# Altium schematic sheet Ethernet.SchDoc
size A4; SheetNumber: 4; SheetTotal: 12
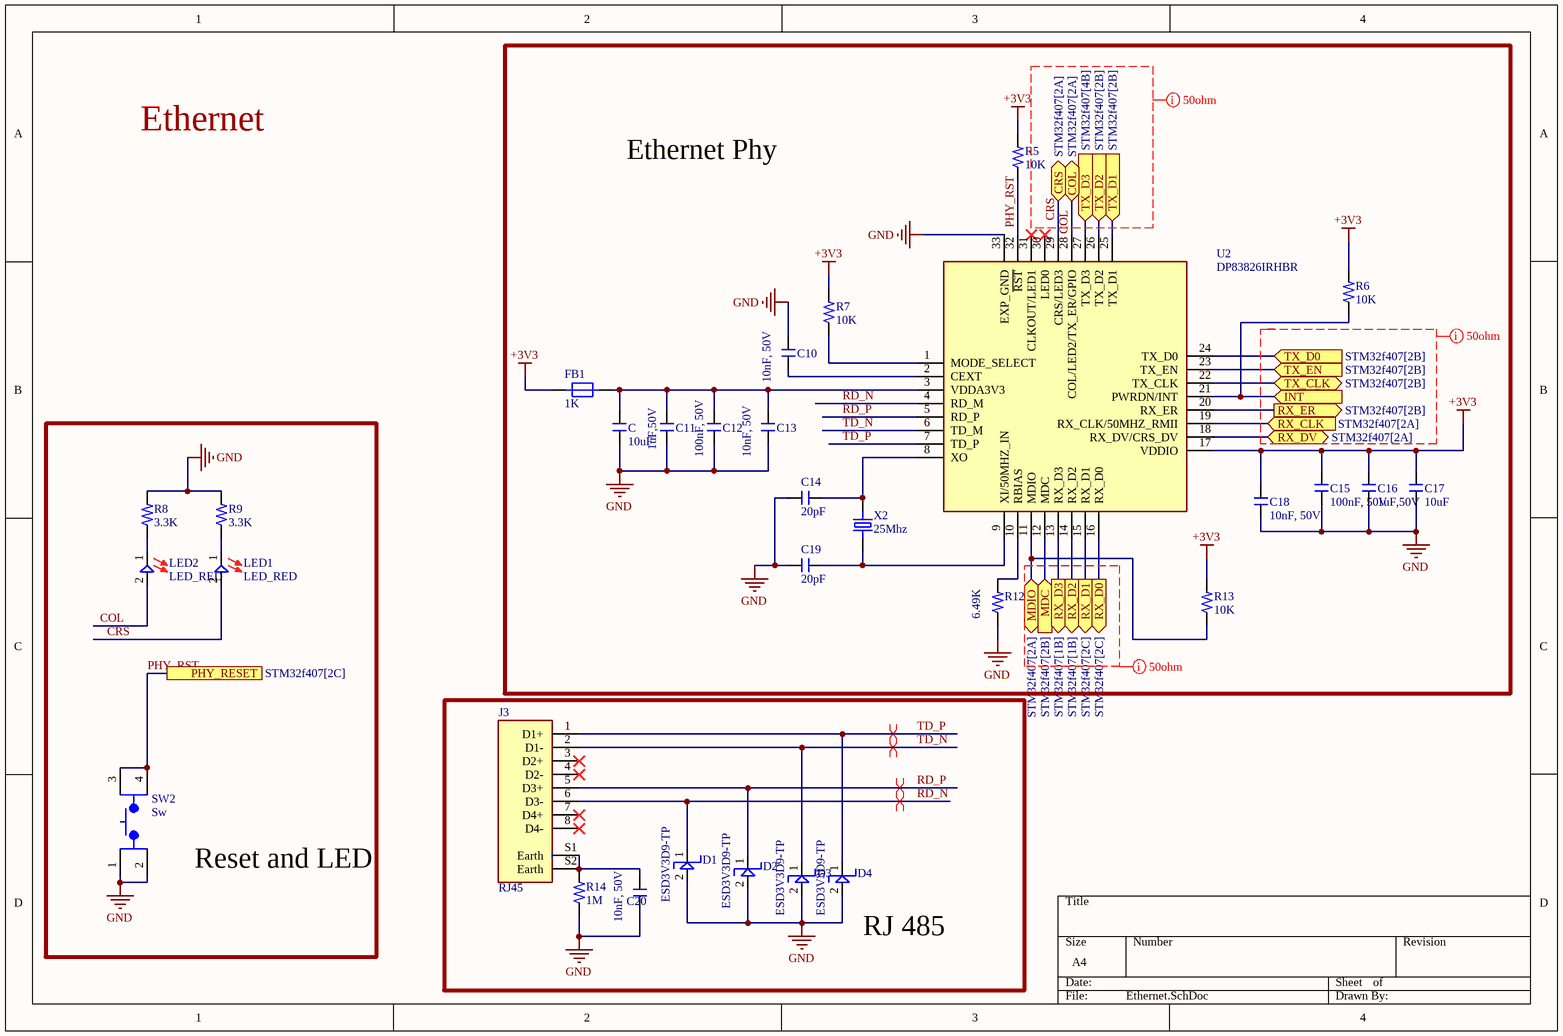
[diagram p0: Ethernet.SchDoc]

## Parts
C  10uF  [Capacitor_1206_SMD]
C10  10nF, 50V  [Capacitor_0805]
C11  1uF,50V  [Capacitor_0805]
C12  100nF, 50V  [Capacitor_0805]
C13  10nF, 50V  [Capacitor_0805]
C14  20pF  [Capacitor_0805]
C15  100nF, 50V  [Capacitor_0805]
C16  1uF,50V  [Capacitor_0805]
C17  10uF  [Capacitor_1206_SMD]
C18  10nF, 50V  [Capacitor_0805]
C19  20pF  [Capacitor_0805]
C20  10nF, 50V  [Capacitor_0805]
D1  ESD3V3D9-TP  [SOD_923]
D2  ESD3V3D9-TP  [SOD_923]
D3  ESD3V3D9-TP  [SOD_923]
D4  ESD3V3D9-TP  [SOD_923]
FB1  1K  [FB_0805]
J3  RJ45  [RJ45_Right_Angle_90_degree]
LED1  LED_RED  [LTST-C171KRKT]
LED2  LED_RED  [LTST-C171KRKT]
R5  10K  [Resistor_0603]
R6  10K  [Resistor_0603]
R7  10K  [Resistor_0603]
R8  3.3K  [Resistor_0603]
R9  3.3K  [Resistor_0603]
R12  6.49K  [Resistor_0805]
R13  10K  [Resistor_0603]
R14  1M  [Resistor_1206_SMD]
SW2  Sw  [SW_Tactile_SMD]
U2  DP83826IRHBR  [32-VQFN (5x5)]
X2  25Mhz  [Xtal_314_240X47_SMD]

## Blocks framed on the sheet
Ethernet Phy: C C10-C19 FB1 R5-R7 R12 R13 U2 X2
Reset and LED: LED1 LED2 R8 R9 SW2
RJ 485: C20 D1-D4 J3 R14

## Ports
COL (bidir, see STM32f407[2A]), CRS (bidir, see STM32f407[2A]), INT (in), MDC (in, see STM32f407[2B]), MDIO (bidir, see STM32f407[2A]), PHY_RESET (see STM32f407[2C]), RX_CLK (in, see STM32f407[2A]), RX_D0 (out, see STM32f407[2C]), RX_D1 (out, see STM32f407[2C]), RX_D2 (out, see STM32f407[1B]), RX_D3 (out, see STM32f407[1B]), RX_DV (bidir, see STM32f407[2A]), RX_ER (out, see STM32f407[2B]), TX_CLK (bidir, see STM32f407[2B]), TX_D0 (in, see STM32f407[2B]), TX_D1 (in, see STM32f407[2B]), TX_D2 (in, see STM32f407[2B]), TX_D3 (in, see STM32f407[4B]), TX_EN (in, see STM32f407[2B])

## Nets
+3V3: C15.2 C16.2 C17.2 C18.2 FB1.1 R5.2 R6.2 R7.2 R13.2 U2.17(VDDIO)
GND: C.1 C10.2 C11.1 C12.1 C13.1 C14.1 C15.1 C16.1 C17.1 C18.1 C19.1 C20.1 D1.2 D2.2 D3.2 D4.2 R8.2 R9.2 R12.1 R14.1 SW2.1 SW2.2 U2.33(EXP_GND)
COL: LED2.2 U2.28(COL/LED2/TX_ER/GPIO) ; port COL
CRS: LED1.2 U2.29(CRS/LED3) ; port CRS
INT: R6.1 U2.21(PWRDN/INT) ; port INT
MDC: U2.12(MDC) ; port MDC
MDIO: R13.1 U2.11(MDIO) ; port MDIO
PHY_RST: R5.1 SW2.3 SW2.4 U2.32(~{RST}) ; port PHY_RESET
RD_N: D1.1 J3.6(D3-) U2.4(RD_M)
RD_P: D2.1 J3.5(D3+) U2.5(RD_P)
RX_CLK: U2.19(RX_CLK/50MHZ_RMII) ; port RX_CLK
RX_D0: U2.16(RX_D0) ; port RX_D0
RX_D1: U2.15(RX_D1) ; port RX_D1
RX_D2: U2.14(RX_D2) ; port RX_D2
RX_D3: U2.13(RX_D3) ; port RX_D3
RX_DV: U2.18(RX_DV/CRS_DV) ; port RX_DV
RX_ER: U2.20(RX_ER) ; port RX_ER
TD_N: D3.1 J3.2(D1-) U2.6(TD_M)
TD_P: D4.1 J3.1(D1+) U2.7(TD_P)
TX_CLK: U2.22(TX_CLK) ; port TX_CLK
TX_D0: U2.24(TX_D0) ; port TX_D0
TX_D1: U2.25(TX_D1) ; port TX_D1
TX_D2: U2.26(TX_D2) ; port TX_D2
TX_D3: U2.27(TX_D3) ; port TX_D3
TX_EN: U2.23(TX_EN) ; port TX_EN
NetC10_1: C10.1 U2.2(CEXT)
NetC14_2: C14.2 U2.8(XO) X2.2
NetC19_2: C19.2 U2.9(XI/50MHZ_IN) X2.1
NetC20_2: C20.2 J3.S1(Earth) J3.S2(Earth) R14.2
NetC_2: C.2 C11.2 C12.2 C13.2 FB1.2 U2.3(VDDA3V3)
NetLED1_1: LED1.1 R9.1
NetLED2_1: LED2.1 R8.1
NetR7_1: R7.1 U2.1(MODE_SELECT)
NetR12_2: R12.2 U2.10(RBIAS)

Not connected (* = marked no-connect by the designer): J3 3(D2+)* 4(D2-)* 7(D4+)* 8(D4-)*; U2 30(LED0)* 31(CLKOUT/LED1)*

## Layout directives
differential pair; net class Diff_Pair_100: RD_N, RD_P, TD_N, TD_P
mark named 50ohm: (no net found under the mark), CRS

## Notes on the sheet
- Ethernet

## Library data of the parts
C C17 = Cap_10uF_1206: Multilayer Ceramic Capacitor, 10 uF, 50 V, ï¿½ 10%, X7R, 1206 [3216 Metric]; Manufacturer: Samsung; Manufacturer Part Number: CL31B106KBHNNNE; Voltage Rating (DC): 50V; Supplier: Digikey; Supplier Part Number: 1276-6767-1-ND; RoHS: Yes; Category: Ceramic Capacitors; Stock: 207136; Pricing: 1=0,25, 10=0,15, 100=0,1008, 1000=0,0728 (USD); Mounting Technology: Surface Mount; Case/Package: 1206; Case Code (Metric): 3216; Case Code (Imperial): 1206; Material: Ceramic; Min Operating Temperature: -55°C; Max Operating Temperature: 125°C; Value: 10uF; Tolerance: 10%; Dielectric: X7R; Packaging: Cut Tape; Voltage Rating: 50V; Series: CL; Height: 1.8mm; Lead Free: Lead Free; RoHS Compliant: Yes; ComponentLink1URL: https://datasheet.octopart.com/CL31B106KBHNNNE-Samsung-Electro-Mechanics-datasheet-149066874.pdf?src-supplier=Future+Electronics; ComponentLink1Description: https://datasheet.octopart.com/CL31B106KBHNNNE-Samsung-Electro-Mechanics-datasheet-149066874.pdf?src-supplier=Future+Electronics; ComponentLink2URL: http://www.samsungsem.com/kr/support/product-search/mlcc/CL31B106KBHNNNE.jsp?src-supplier=Digikey; ComponentLink2Description: http://www.samsungsem.com/kr/support/product-search/mlcc/CL31B106KBHNNNE.jsp?src-supplier=Digikey; ComponentLink3URL: https://datasheet.octopart.com/CL31B106KBHNNNE-Samsung-Electro-Mechanics-datasheet-137256395.pdf?src-supplier=Farnell; ComponentLink3Description: https://datasheet.octopart.com/CL31B106KBHNNNE-Samsung-Electro-Mechanics-datasheet-137256395.pdf?src-supplier=Farnell; ComponentLink4URL: https://datasheet.octopart.com/CL31B106KBHNNNE-Samsung-Electro-Mechanics-datasheet-110617700.pdf?src-supplier=LCSC; ComponentLink4Description: https://datasheet.octopart.com/CL31B106KBHNNNE-Samsung-Electro-Mechanics-datasheet-110617700.pdf?src-supplier=LCSC
C10 C13 C18 C20 = Cap_10nF_0805: Multilayer Ceramic Capacitors MLCC - SMD/SMT 50V 0.01uF X7R 0805 10% AEC-Q200; Manufacturer: KEMET; Manufacturer Part Number: C0805C103K5RECAUTO; Dielectric: 1511DielectricType; Supplier: Arrow Electronics; Supplier Part Number: C0805C103K5RECAUTO; RoHS: Yes; Category: Ceramic Capacitors; Stock: 16; Pricing: 1=0,22, 10=0,0376 (USD); Voltage Rating (DC): 50V; ComponentLink1URL: http://www.farnell.com/datasheets/2723804.pdf?src-supplier=Farnell; ComponentLink1Description: http://www.farnell.com/datasheets/2723804.pdf?src-supplier=Farnell; ComponentLink2URL: https://api.kemet.com/component-edge/download/datasheet/C0805C103K5RECAUTO.pdf?src-supplier=Digikey; ComponentLink2Description: https://api.kemet.com/component-edge/download/datasheet/C0805C103K5RECAUTO.pdf?src-supplier=Digikey; ComponentLink3URL: http://www.farnell.com/datasheets/2723804.pdf?src-supplier=Newark; ComponentLink3Description: http://www.farnell.com/datasheets/2723804.pdf?src-supplier=Newark
C11 C16 = Cap_1uF_0805: 0805 1 uF 50 V ±5 % Tolerance X7R Surface Mount Multilayer Ceramic Capacitor; Manufacturer: Yageo; Manufacturer Part Number: CC0805JKX7R9BB105; Material: 4241ConductorMaterial; Dielectric: 1511DielectricType; Supplier: Digikey; Supplier Part Number: 311-3498-1-ND; RoHS: Yes; Category: Ceramic Capacitors; Stock: 30160; Pricing: 1=0,29, 10=0,168, 100=0,1077, 1000=0,07673 (USD); Voltage Rating (DC): 50V; Height: 1.45mm; Lead Free: 5697LeadFree; Halogen Free: 5694HalogenFree; ComponentLink1URL: https://datasheet.octopart.com/CC0805JKX7R9BB105-Yageo-datasheet-137700082.pdf?src-supplier=Future+Electronics; ComponentLink1Description: https://datasheet.octopart.com/CC0805JKX7R9BB105-Yageo-datasheet-137700082.pdf?src-supplier=Future+Electronics; ComponentLink2URL: http://www.yageo.com/documents/recent/UPY-GPHC_X7R_6.3V-to-50V_18.pdf?src-supplier=Digikey; ComponentLink2Description: http://www.yageo.com/documents/recent/UPY-GPHC_X7R_6.3V-to-50V_18.pdf?src-supplier=Digikey; ComponentLink3URL: https://datasheet.octopart.com/CC0805JKX7R9BB105-Yageo-datasheet-151948686.pdf?src-supplier=Farnell; ComponentLink3Description: https://datasheet.octopart.com/CC0805JKX7R9BB105-Yageo-datasheet-151948686.pdf?src-supplier=Farnell
C12 C15 = Cap_100nF_0805: Multilayer Ceramic Capacitor, 0.1 uF, 50 V, ï¿½ 10%, X7R, 0805 [2012 Metric]; Manufacturer: Samsung; Manufacturer Part Number: CL21B104KBCNNNC; Supplier: Digikey; Supplier Part Number: 1276-1003-1-ND; RoHS: Yes; Category: Ceramic Capacitors; Stock: 674609; Pricing: 1=0,08, 10=0,012, 100=0,0104, 1000=0,008 (USD); Mounting Technology: Surface Mount; Case/Package: 0805; Case Code (Metric): 2012; Case Code (Imperial): 0805; Material: Ceramic; Min Operating Temperature: -55°C; Max Operating Temperature: 125°C; Tolerance: 10%; Value: 100nF; Dielectric: X7R; Packaging: Tape and Reel; Voltage Rating: 50V; Voltage: 50V; Series: CL; Construction: Flat; Voltage Rating (DC): 50V; Length: 2mm; Width: 0.049inch; Height: 0.85mm; Depth: 1.25mm; Thickness: 0.037inch; Radiation Hardening: No; RoHS Compliant: Yes; Lead Free: 5697LeadFree; ComponentLink1URL: https://datasheet.ciiva.com/25710/cl21b104kbcnnnc-25710182.pdf?src-supplier=Digikey; ComponentLink1Description: https://datasheet.ciiva.com/25710/cl21b104kbcnnnc-25710182.pdf?src-supplier=Digikey; ComponentLink2URL: https://datasheet.ciiva.com/29199/454152-da-01-en-vs-kondensator-0805-29199814.pdf?src-supplier=Conrad; ComponentLink2Description: https://datasheet.ciiva.com/29199/454152-da-01-en-vs-kondensator-0805-29199814.pdf?src-supplier=Conrad
C14 C19 = Cap_20pF_0805: Cap Ceramic 20pF 50V C0G 10% SMD 0805 125°C T/R; Manufacturer: Kyocera AVX; Manufacturer Part Number: 08055A200KAT2A; Supplier: Digikey; Supplier Part Number: 478-11887-1-ND; RoHS: Yes; Category: Ceramic Capacitors; Stock: 12473; Pricing: 1=0,19, 10=0,108, 100=0,0669, 1000=0,04597 (USD); ComponentLink1URL: https://datasheet.ciiva.com/204/ccog-204009.pdf?src-supplier=Digikey; ComponentLink1Description: https://datasheet.ciiva.com/204/ccog-204009.pdf?src-supplier=Digikey; ComponentLink2URL: https://datasheet.ciiva.com/11546/ccog-11546664.pdf?src-supplier=Avnet; ComponentLink2Description: https://datasheet.ciiva.com/11546/ccog-11546664.pdf?src-supplier=Avnet
D1-D4 = TVS DIODE 3.3V: Trans Voltage Suppressor Diode, 100W, 3.3V V(RWM), Unidirectional, 1 Element, Silicon; Manufacturer: MCC; Supplier: Digikey; Supplier Part Number: ESD3V3D9-TPMSCT-ND; Manufacturer Part Number: ESD3V3D9-TP; RoHS: Yes; Category: TVS Diodes; Stock: 58922; Pricing: 1=0,21, 10=0,143, 100=0,067, 500=0,063, 1000=0,059, 2000=0,058 (USD); ComponentLink1URL: https://datasheet.ciiva.com/4479/esd3v3d9sod-923-36448-4479598.pdf?src-supplier=Mouser; ComponentLink1Description: https://datasheet.ciiva.com/4479/esd3v3d9sod-923-36448-4479598.pdf?src-supplier=Mouser; ComponentLink2URL: https://datasheet.ciiva.com/333/esd3v3d9sod-923-333173.pdf?src-supplier=Digikey; ComponentLink2Description: https://datasheet.ciiva.com/333/esd3v3d9sod-923-333173.pdf?src-supplier=Digikey; ComponentLink3URL: https://datasheet.ciiva.com/333/esd3v3d9sod-923-333174.pdf?src-supplier=Digikey; ComponentLink3Description: https://datasheet.ciiva.com/333/esd3v3d9sod-923-333174.pdf?src-supplier=Digikey; ComponentLink4URL: https://datasheet.ciiva.com/333/esd3v3d9sod-923-333175.pdf?src-supplier=Digikey; ComponentLink4Description: https://datasheet.ciiva.com/333/esd3v3d9sod-923-333175.pdf?src-supplier=Digikey
FB1 = FB_BLM21SP102SH1D: Ferrite Beads Multi-Layer High Current 1KOhm 25% 100MHz 1.6A 0.12Ohm DCR 0805 Automotive T/R; Manufacturer: Murata; Core Material: 228ConductorMaterial; Value: 120mR; Supplier: Mouser; Supplier Part Number: 81-BLM21SP102SH1D; Manufacturer Part Number: BLM21SP102SH1D; RoHS: Yes; Category: Ferrite Beads and Chips; Stock: 4751; Pricing: 1=0,33, 10=0,179, 50=0,179, 100=0,159, 1000=0,105, 10000=0,083 (USD); RMS Current (Irms): 1.6A; ESR: 120mR; Test Frequency: 100MHz; Tolerance: 25%; Height: 1.05mm; ComponentLink1URL: https://datasheet.octopart.com/BLM21SP102SH1D-Murata-datasheet-138707452.pdf?src-supplier=Future+Electronics; ComponentLink1Description: https://datasheet.octopart.com/BLM21SP102SH1D-Murata-datasheet-138707452.pdf?src-supplier=Future+Electronics; ComponentLink2URL: https://www.murata.com/en-us/api/pdfdownloadapi?cate=luNoiseSupprFilteChipFerriBead&amp;partno=BLM21SP102SH1%23&src-supplier=Digikey; ComponentLink2Description: https://www.murata.com/en-us/api/pdfdownloadapi?cate=luNoiseSupprFilteChipFerriBead&amp;partno=BLM21SP102SH1%23&src-supplier=Digikey; ComponentLink3URL: https://datasheet.octopart.com/BLM21SP102SH1D-Murata-datasheet-166171483.pdf?src-supplier=TME; ComponentLink3Description: https://datasheet.octopart.com/BLM21SP102SH1D-Murata-datasheet-166171483.pdf?src-supplier=TME
J3 = CON_LAN_RJ45: Conn RJ-45 F 8 POS 2.54mm Solder RA Thru-Hole 8 Terminal 1 Port; Manufacturer: Assmann; Manufacturer Part Number: A-2004-2-4-LPS-N-R; Supplier: Digikey; Supplier Part Number: AE10387-ND; RoHS: Yes; Category: Modular / Ethernet Connectors; Stock: 16450; Pricing: 1=1,39, 10=1,178, 25=1,1036, 50=1,0508, 100=1,0006, 300=0,92593, 500=0,89314, 1000=0,85049, 2500=0,79726 (USD); ComponentLink1URL: https://datasheet.ciiva.com/30247/a-2004-2-4-lps-n-r-30247832.pdf?src-supplier=Onlinecomponents.com; ComponentLink1Description: https://datasheet.ciiva.com/30247/a-2004-2-4-lps-n-r-30247832.pdf?src-supplier=Onlinecomponents.com; ComponentLink2URL: https://datasheet.ciiva.com/685/a-2004-2-4-lps-n-r-685830.pdf?src-supplier=Digikey; ComponentLink2Description: https://datasheet.ciiva.com/685/a-2004-2-4-lps-n-r-685830.pdf?src-supplier=Digikey
LED1 LED2 = LED_RED_SMD: OPTOELECTRONICS - SMD Chip LED - TopView Single Color Chip LED, Red, 631 at 20mA, 18 to approx. 180 at 20mA; Manufacturer: Vishay Lite-On; Wavelength: 631nm; Supplier: Digikey; Supplier Part Number: 160-1427-1-ND; Manufacturer Part Number: LTST-C171KRKT; RoHS: Yes; Category: LEDs; Stock: 98881; Pricing: 1=0,15, 10=0,105, 100=0,0723, 500=0,05736, 1000=0,05238 (USD); Lead Free: 5697LeadFree; ComponentLink1URL: https://datasheet.ciiva.com/11775/0900766b80dc0299-11775643.pdf?src-supplier=Rs; ComponentLink1Description: https://datasheet.ciiva.com/11775/0900766b80dc0299-11775643.pdf?src-supplier=Rs; ComponentLink2URL: https://datasheet.ciiva.com/12403/lite-on-ltst-c171krkt-187201-12403781.pdf?src-supplier=Mouser; ComponentLink2Description: https://datasheet.ciiva.com/12403/lite-on-ltst-c171krkt-187201-12403781.pdf?src-supplier=Mouser; ComponentLink3URL: https://datasheet.ciiva.com/16444/lite-on20ltst-c171krkt-16444779.pdf?src-supplier=Future+Electronics; ComponentLink3Description: https://datasheet.ciiva.com/16444/lite-on20ltst-c171krkt-16444779.pdf?src-supplier=Future+Electronics; ComponentLink4URL: https://datasheet.ciiva.com/2110/s-110-ltst-c171krkt-2110066.pdf?src-supplier=Digikey; ComponentLink4Description: https://datasheet.ciiva.com/2110/s-110-ltst-c171krkt-2110066.pdf?src-supplier=Digikey; ComponentLink5URL: https://datasheet.ciiva.com/2110/s-110-ltst-c171krkt-2110067.pdf?src-supplier=Digikey; ComponentLink5Description: https://datasheet.ciiva.com/2110/s-110-ltst-c171krkt-2110067.pdf?src-supplier=Digikey; ComponentLink6URL: https://datasheet.ciiva.com/2110/s-110-ltst-c171krkt-2110068.pdf?src-supplier=Digikey; ComponentLink6Description: https://datasheet.ciiva.com/2110/s-110-ltst-c171krkt-2110068.pdf?src-supplier=Digikey
R5-R7 R13 = R_10K_0603: SMD Chip Resistor, 10 kOhm, ï¿½ 1%, 100 mW, 0603 [1608 Metric], Thick Film, General Purpose; Manufacturer: Yageo; Manufacturer Part Number: RC0603FR-0710KL; Voltage Rating (DC): 50V; Value: 10kR; Temperature Coefficient: 100ppm/°C; Voltage Rating: 75V; Power Rating: 100mW; Supplier: Digikey; Supplier Part Number: 311-10.0KHRCT-ND; RoHS: Yes; Category: Chip SMD Resistors; Stock: 2808060; Pricing: 1=0,1, 10=0,009, 100=0,0071, 1000=0,00612 (USD); Case/Package: 0603; Pins: 2; Case Code (Imperial): 0603; Case Code (Metric): 1608; Weight: 7.1E-05oz; Min Operating Temperature: -55°C; Max Operating Temperature: 155°C; Tolerance: 1%; Resistor Type: Thick Film; Packaging: Tape and Reel; Termination: SMD/SMT; Features: Moisture Resistant; Series: RC; Max Power Dissipation: 100mW; Number of Terminations: 2; Resistance Tolerance: 1%; Construction: Rectangular; Length: 1.6mm; Width: 0.8mm; Height: 0.45mm; Depth: 0.8mm; Lead Pitch: 0.3mm; Reach SVHC Compliant: No; Lead Free: 5697LeadFree; RoHS Compliant: Yes; Military Standard: Not; ComponentLink1URL: https://datasheet.ciiva.com/7660/38590-7660789.pdf?src-supplier=Element14; ComponentLink1Description: https://datasheet.ciiva.com/7660/38590-7660789.pdf?src-supplier=Element14; ComponentLink2URL: https://datasheet.ciiva.com/7983/443971-7983596.pdf?src-supplier=Element14; ComponentLink2Description: https://datasheet.ciiva.com/7983/443971-7983596.pdf?src-supplier=Element14; ComponentLink3URL: https://datasheet.ciiva.com/22747/443971-22747519.pdf?src-supplier=Element14; ComponentLink3Description: https://datasheet.ciiva.com/22747/443971-22747519.pdf?src-supplier=Element14; ComponentLink4URL: https://datasheet.ciiva.com/46440/1868787-46440891.pdf?src-supplier=Element14; ComponentLink4Description: https://datasheet.ciiva.com/46440/1868787-46440891.pdf?src-supplier=Element14; ComponentLink5URL: https://datasheet.ciiva.com/7746/1738695-7746239.pdf?src-supplier=Element14; ComponentLink5Description: https://datasheet.ciiva.com/7746/1738695-7746239.pdf?src-supplier=Element14; ComponentLink6URL: https://datasheet.ciiva.com/15189/getdatasheetpartid-409289-15189591.pdf?src-supplier=Verical; ComponentLink6Description: https://datasheet.ciiva.com/15189/getdatasheetpartid-409289-15189591.pdf?src-supplier=Verical
R8 R9 = R_3.3K_0603: Res Thick Film 0603 3.3K Ohm 1% 0.1W(1/10W) ±100ppm/C Pad SMD T/R; Manufacturer: Walsin Technologies; Manufacturer Part Number: WR06X3301FTL; Value: 3.3kR; Voltage Rating: 75V; Power Rating: 100mW; Temperature Coefficient: 100ppm/°C; Supplier: Digikey; Supplier Part Number: 1292-WR06X3301FTLCT-ND; RoHS: Yes; Category: Chip SMD Resistors; Stock: 24599; Pricing: 1=0,1, 10=0,015, 50=0,0086, 100=0,0068, 500=0,00418, 1000=0,00345 (USD); Mounting Technology: Surface Mount; Case/Package: 0603; Case Code (Metric): 1608; Case Code (Imperial): 0603; Contact Material: 154ConductorMaterial; Resistor Type: Thick Film; Packaging: Tape and Reel; Resistance Tolerance: 1%; Voltage Rating (DC): 75V; Reach SVHC Compliant: Unknown; RoHS Compliant: Yes; Lead Free: 5697LeadFree; ComponentLink1URL: http://www.farnell.com/datasheets/1960319.pdf?src-supplier=Farnell; ComponentLink1Description: http://www.farnell.com/datasheets/1960319.pdf?src-supplier=Farnell; ComponentLink2URL: https://datasheet.octopart.com/WR06X3301FTL-Walsin-Technologies-datasheet-48038251.pdf?src-supplier=Element14; ComponentLink2Description: https://datasheet.octopart.com/WR06X3301FTL-Walsin-Technologies-datasheet-48038251.pdf?src-supplier=Element14; ComponentLink3URL: http://www.farnell.com/datasheets/1960319.pdf?src-supplier=Element14; ComponentLink3Description: http://www.farnell.com/datasheets/1960319.pdf?src-supplier=Element14; ComponentLink4URL: https://datasheet.octopart.com/WR06X3301FTL-Walsin-Technologies-datasheet-32780790.pdf?src-supplier=Future+Electronics; ComponentLink4Description: https://datasheet.octopart.com/WR06X3301FTL-Walsin-Technologies-datasheet-32780790.pdf?src-supplier=Future+Electronics
R12 = R_6.49K_0805: SMD Chip Resistor, 6.49 kOhm, ï¿½ 1%, 125 mW, 0805 [2012 Metric], Thick Film, General Purpose; Manufacturer: Yageo; Manufacturer Part Number: RC0805FR-076K49L; Supplier: Digikey; Supplier Part Number: 311-6.49KCRCT-ND; RoHS: Yes; Category: Chip SMD Resistors; Stock: 48332; Pricing: 1=0,1, 10=0,011, 100=0,0082, 1000=0,00714 (USD); Lead Free: 5697LeadFree; ComponentLink1URL: https://datasheet.ciiva.com/2519/pyu-r-int-thick-7-2519753.pdf?src-supplier=Digikey; ComponentLink1Description: https://datasheet.ciiva.com/2519/pyu-r-int-thick-7-2519753.pdf?src-supplier=Digikey; ComponentLink2URL: https://datasheet.ciiva.com/2519/pyu-r-int-thick-7-2519754.pdf?src-supplier=Digikey; ComponentLink2Description: https://datasheet.ciiva.com/2519/pyu-r-int-thick-7-2519754.pdf?src-supplier=Digikey; ComponentLink3URL: https://datasheet.ciiva.com/2519/pyu-r-int-thick-7-2519755.pdf?src-supplier=Digikey; ComponentLink3Description: https://datasheet.ciiva.com/2519/pyu-r-int-thick-7-2519755.pdf?src-supplier=Digikey; ComponentLink4URL: https://datasheet.ciiva.com/17045/rc0805-17045354.pdf?src-supplier=Future+Electronics; ComponentLink4Description: https://datasheet.ciiva.com/17045/rc0805-17045354.pdf?src-supplier=Future+Electronics
R14 = R_1M_1206: Res Thick Film 1206 1M Ohm 1% 0.25W(1/4W) ±100ppm/C Molded SMD Paper T/R; Manufacturer: Walsin Technologies; Manufacturer Part Number: WR12X1004FTL; Voltage Rating (DC): 200V; Value: 1MR; Power Rating: 250mW; Temperature Coefficient: 100ppm/°C; Supplier: Digikey; Supplier Part Number: 1292-WR12X1004FTLCT-ND; RoHS: Yes; Category: Chip SMD Resistors; Stock: 25189; Pricing: 1=0,1, 10=0,03, 50=0,0178, 100=0,0146, 500=0,00964, 1000=0,00821 (USD); Mounting Technology: Surface Mount; Case/Package: Molded; Case Code (Metric): 3216; Case Code (Imperial): 1206; Contact Material: 154ConductorMaterial; Min Operating Temperature: -55°C; Max Operating Temperature: 155°C; Packaging: Tape and Reel; Tolerance: 1%; Resistor Type: Thick Film; Voltage Rating: 200V; Resistance Tolerance: 1%; Construction: Rectangular; Length: 3.1mm; Depth: 1.6mm; Military Standard: Not; RoHS Compliant: Yes; Reach SVHC Compliant: Unknown; Lead Free: 5697LeadFree; ComponentLink1URL: http://www.farnell.com/datasheets/1960319.pdf?src-supplier=Farnell; ComponentLink1Description: http://www.farnell.com/datasheets/1960319.pdf?src-supplier=Farnell; ComponentLink2URL: https://www.verical.com/server-webapp/html/getDatasheet?partID=137179&src-supplier=Verical; ComponentLink2Description: https://www.verical.com/server-webapp/html/getDatasheet?partID=137179&src-supplier=Verical; ComponentLink3URL: https://datasheet.octopart.com/WR12X1004FTL-Walsin-Technologies-datasheet-48038251.pdf?src-supplier=Element14; ComponentLink3Description: https://datasheet.octopart.com/WR12X1004FTL-Walsin-Technologies-datasheet-48038251.pdf?src-supplier=Element14
SW2 = SW_Tactile_SPST: TL3305A Series SPST 12 V 4.5 x 4.5 mm 260 gf Top Actuated SMT Tactile Switch; Manufacturer: E-Switch; Manufacturer Part Number: TL3305AF260QG; Mechanical Life: 200000Cycles; Illumination Type: Non-Illuminated; Operating Force: 260gf; Switch Travel: 0.2mm; Switch Function: Off-Mom; Actuator Type: Standard; Supplier: Digikey; Supplier Part Number: EG5353CT-ND; RoHS: No; Category: Tactile Switches; Stock: 97166; Pricing: 1=0,2, 10=0,176, 25=0,1664, 100=0,153, 250=0,14456, 500=0,1385, 1000=0,13264 (USD); Mounting Technology: Surface Mount; Min Operating Temperature: -20°C; Max Operating Temperature: 70°C; Packaging: Cut Tape; Termination: Gull Wing; Throw Configuration: SPST; Series: TL3305; Lead Free: Lead Free; ComponentLink1URL: http://www.farnell.com/datasheets/2554191.pdf?src-supplier=Farnell; ComponentLink1Description: http://www.farnell.com/datasheets/2554191.pdf?src-supplier=Farnell; ComponentLink2URL: http://www.farnell.com/datasheets/2554191.pdf?src-supplier=Newark; ComponentLink2Description: http://www.farnell.com/datasheets/2554191.pdf?src-supplier=Newark; ComponentLink3URL: http://spec_sheets.e-switch.com/specs/P010471.pdf?src-supplier=Mouser; ComponentLink3Description: http://spec_sheets.e-switch.com/specs/P010471.pdf?src-supplier=Mouser; ComponentLink4URL: http://www.farnell.com/datasheets/2554191.pdf?src-supplier=Element14; ComponentLink4Description: http://www.farnell.com/datasheets/2554191.pdf?src-supplier=Element14; ComponentLink5URL: http://spec_sheets.e-switch.com/specs/P010471.pdf?src-supplier=Digikey; ComponentLink5Description: http://spec_sheets.e-switch.com/specs/P010471.pdf?src-supplier=Digikey; ComponentLink6URL: http://spec_sheets.e-switch.com/specs/P010471.pdf?src-supplier=NAC+Semi; ComponentLink6Description: http://spec_sheets.e-switch.com/specs/P010471.pdf?src-supplier=NAC+Semi
U2 = IC_DP83826IRHBR: Ethernet PHY 10BASE-Te/00BASE-TX 10/100 Mbps 160mW 1.8V/3.3V 2-Pin VQFN Industrial; Manufacturer: Texas Instruments; Interface: 1515Interface; Max Supply Voltage: 3.6V; Min Supply Voltage: 1.62V; Number of Channels: 1NUMBER; Supplier: Mouser; Supplier Part Number: 595-DP83826IRHBR; Manufacturer Part Number: DP83826IRHBR; RoHS: Yes; Category: Ethernet Interface ICs; Stock: 7439; Pricing: 1=1,95, 10=1,44, 50=1,32, 100=1,17, 1000=1,03, 10000=0,986 (USD); Pins: 32NUMBER; Data Rate: 100Mbps; Length: 5mm; Width: 5mm; Height: 1mm; Thickness: 900um
X2 = Xtal_25MHz: Crystal 25MHz ±30ppm (Tol) ±50ppm (Stability) 20pF 2-Pin HC-49/SDLF SMD T/R; Manufacturer: Fox Electronics; Manufacturer Part Number: FC4SDCBMF25.0-T1; Supplier: Digikey; Supplier Part Number: 631-FC4SDCBMF25.0-T1CT-ND; RoHS: Yes; Stock: 31979; Pricing: 1=0,24, 10=0,208, 50=0,1888, 100=0,181, 500=0,16406 (USD); ComponentLink1URL: http://datasheet.octopart.com/FC4SDCBMF25.0-T1-Fox-Electronics-datasheet-136840669.pdf?src-supplier=Avnet; ComponentLink1Description: http://datasheet.octopart.com/FC4SDCBMF25.0-T1-Fox-Electronics-datasheet-136840669.pdf?src-supplier=Avnet; ComponentLink2URL: http://www.foxonline.com/pdfs/C4SD.pdf?src-supplier=Digikey; ComponentLink2Description: http://www.foxonline.com/pdfs/C4SD.pdf?src-supplier=Digikey; ComponentLink3URL: http://datasheet.octopart.com/FC4SDCBMF25.0-T1-Fox-Electronics-datasheet-136840669.pdf?src-supplier=Digikey; ComponentLink3Description: http://datasheet.octopart.com/FC4SDCBMF25.0-T1-Fox-Electronics-datasheet-136840669.pdf?src-supplier=Digikey; ComponentLink4URL: http://datasheet.octopart.com/FC4SDCBMF25.0-T1-Fox-Electronics-datasheet-136840669.pdf?src-supplier=Onlinecomponents.com; ComponentLink4Description: http://datasheet.octopart.com/FC4SDCBMF25.0-T1-Fox-Electronics-datasheet-136840669.pdf?src-supplier=Onlinecomponents.com; ComponentLink5URL: http://datasheet.octopart.com/FC4SDCBMF25.0-T1-Fox-Electronics-datasheet-136840669.pdf?src-supplier=Verical; ComponentLink5Description: http://datasheet.octopart.com/FC4SDCBMF25.0-T1-Fox-Electronics-datasheet-136840669.pdf?src-supplier=Verical; ComponentLink6URL: https://datasheet.octopart.com/FC4SDCBMF25.0-T1-Fox-Electronics-datasheet-136840669.pdf?src-supplier=Future+Electronics; ComponentLink6Description: https://datasheet.octopart.com/FC4SDCBMF25.0-T1-Fox-Electronics-datasheet-136840669.pdf?src-supplier=Future+Electronics; ComponentLink7URL: http://datasheet.octopart.com/FC4SDCBMF25.0-T1-Fox-Electronics-datasheet-136840669.pdf?src-supplier=NAC+Semi; ComponentLink7Description: http://datasheet.octopart.com/FC4SDCBMF25.0-T1-Fox-Electronics-datasheet-136840669.pdf?src-supplier=NAC+Semi; ComponentLink8URL: http://datasheet.octopart.com/FC4SDCBMF25.0-T1-Fox-Electronics-datasheet-136840669.pdf?src-supplier=Electro+Sonic; ComponentLink8Description: http://datasheet.octopart.com/FC4SDCBMF25.0-T1-Fox-Electronics-datasheet-136840669.pdf?src-supplier=Electro+Sonic